# Altium project KIT_PIC16F877A.PrjPcb
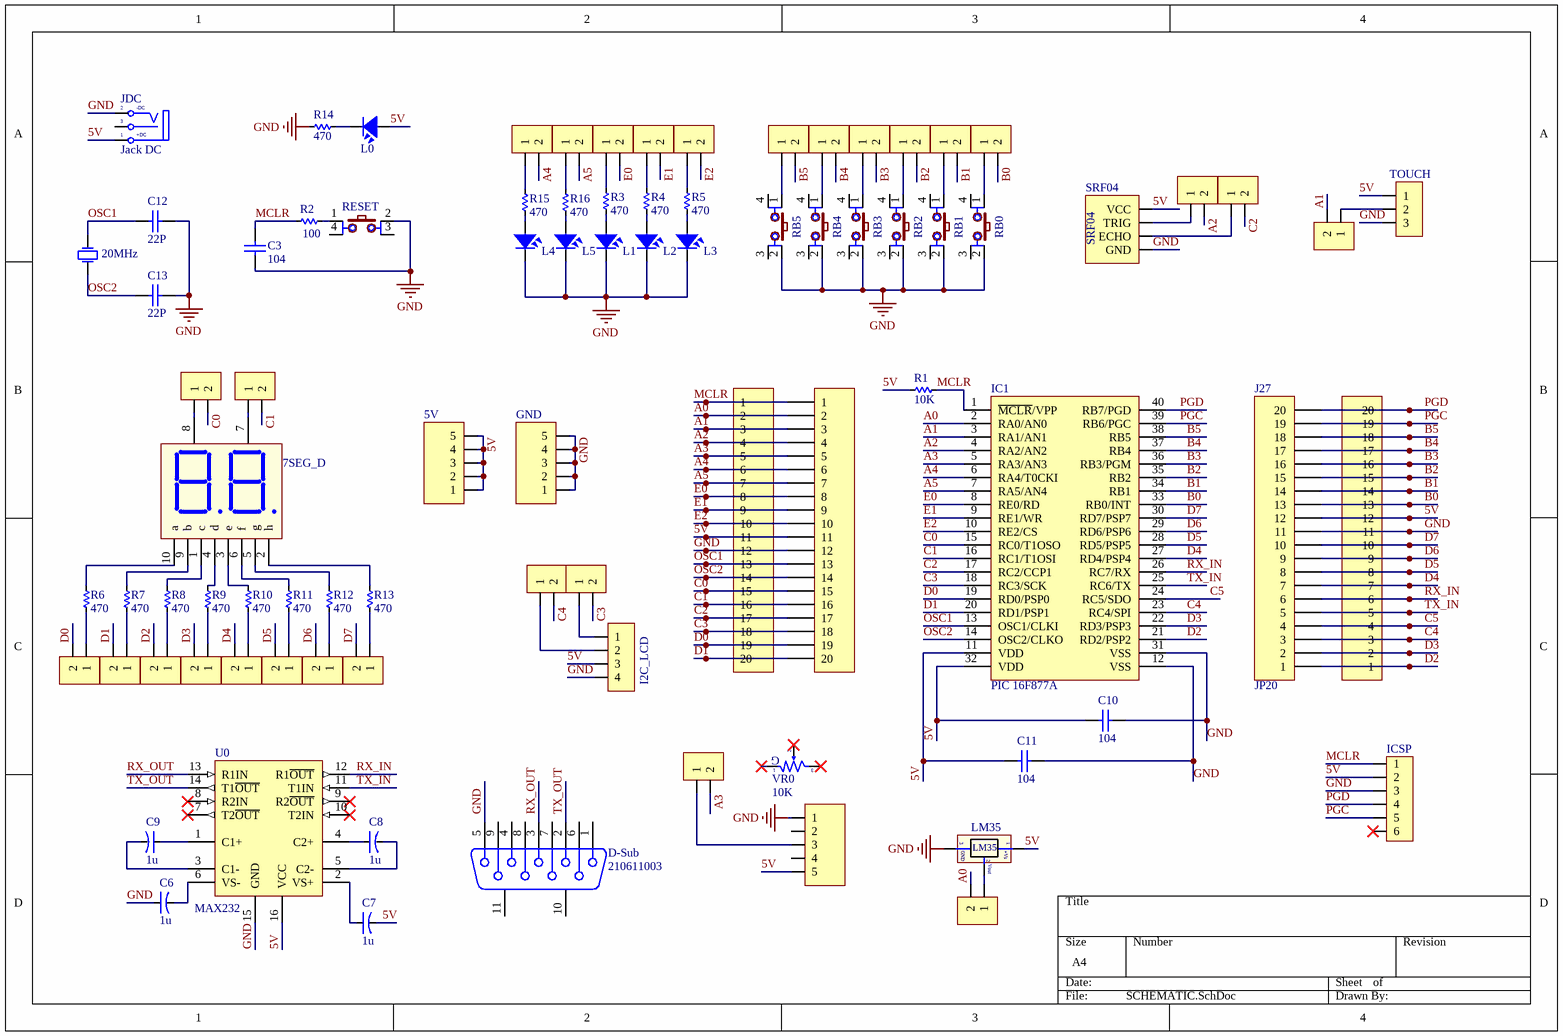
[diagram p0: SCHEMATIC.SchDoc]
1 sheet, 85 parts. Net scope: global (net labels, ports and power ports of the same name join across sheets).
Board file: PCB_KIT_PIC16F877A.PcbDoc

## Sheet SCHEMATIC.SchDoc
size A4; PageSetup: Record=PageOptions|CenterHorizontal=True|CenterVertical=True|PrintScale=0.94|XCorrection=0.00|YCorrection=0.00|PrintKind=0|BorderSize=5000000|LeftOffset=0|BottomOffset=0|Orientation=2|PaperLength=1000|PaperWidth=1000|Scale=100|PaperSource=7|PrintQuality=-3|MediaType=1|DitherType=10|PrintScaleMode=1|PaperKind=A4|PaperIndex=9

### Parts
5V  JP5  [JP5-C1T]  (value not drawn)
C3  value 104  [CN1.5]  (hidden comment: Cap Non-Pol)
C6  1u  [CA-ALU-2.54]
C7  1u  [CA-ALU-2.54]
C8  1u  [CA-ALU-2.54]
C9  1u  [CA-ALU-2.54]
C10  value 104  [CN1.5]  (hidden comment: Cap Non-Pol)
C11  value 104  [CN1.5]  (hidden comment: Cap Non-Pol)
C12  value 22P  [CN1.5]  (hidden comment: Cap Non-Pol)
C13  value 22P  [CN1.5]  (hidden comment: Cap Non-Pol)
D-Sub  210611003  [COM9B]
DS0  7SEG_D  [7SEG-D]
GND  JP5  [JP5-C1T]  (value not drawn)
I2C_LCD  JP4  [JP4-C1T]  (value not drawn)
IC1  PIC 16F877A  [DIP40_Socket]
ICSP  Header6  [Header6]  (value not drawn)
J0  JP20  [JP20-C1T]  (value not drawn)
J2  JP20  [JP20-D1T]  (value not drawn)
J26  JP20  [JP20-C1T]  (value not drawn)
J27  JP20  [JP20-D1T]
J28  JP5  [JP5-C1T]  (value not drawn)
J29  JP2  [JP2-D1T]  (value not drawn)
JDC  Jack DC  [DC0]
JP0  JP2  [JP2-D1T]  (value not drawn)
JP1  JP2  [JP2-D1T]  (value not drawn)
JP2  JP2  [JP2-D1T]  (value not drawn)
JP3  JP2  [JP2-D1T]  (value not drawn)
JP4  JP2  [JP2-D1T]  (value not drawn)
JP5  JP2  [JP2-D1T]  (value not drawn)
JP6  JP2  [JP2-D1T]  (value not drawn)
JP7  JP2  [JP2-D1T]  (value not drawn)
JP8  JP2  [JP2-D1T]  (value not drawn)
JP9  JP2  [JP2-D1T]  (value not drawn)
JP10  JP2  [JP2-D1T]  (value not drawn)
JP11  JP2  [JP2-D1T]  (value not drawn)
JP12  JP2  [JP2-D1T]  (value not drawn)
JP13  JP2  [JP2-D1T]  (value not drawn)
JP14  JP2  [JP2-D1T]  (value not drawn)
JP15  JP2  [JP2-D1T]  (value not drawn)
JP16  JP2  [JP2-D1T]  (value not drawn)
JP17  JP2  [JP2-D1T]  (value not drawn)
JP18  JP2  [JP2-D1T]  (value not drawn)
JP19  JP2  [JP2-D1T]  (value not drawn)
JP20  JP2  [JP2-D1T]  (value not drawn)
JP21  JP2  [JP2-D1T]  (value not drawn)
JP22  JP2  [JP2-D1T]  (value not drawn)
JP23  JP2  [JP2-D1T]  (value not drawn)
JP25  JP2  [JP2-D1T]  (value not drawn)
JP26  JP2  [JP2-D1T]  (value not drawn)
JP27  JP2  [JP2-D1T]  (value not drawn)
L0  LED  [LED-5-RED]  (value not drawn)
L1  LED  [LED-5-RED]  (value not drawn)
L2  LED  [LED-5-RED]  (value not drawn)
L3  LED  [LED-5-RED]  (value not drawn)
L4  LED  [LED-5-RED]  (value not drawn)
L5  LED  [LED-5-RED]  (value not drawn)
LM35  LM35  [TO92-123]  (value not drawn)
R1  10K  [RES-1/4W-SMALL]
R2  100  [RES-1/4W-SMALL]
R3  470  [RES-1/4W-SMALL]
R4  470  [RES-1/4W-SMALL]
R5  470  [RES-1/4W-SMALL]
R6  470  [RES-1/4W-SMALL]
R7  470  [RES-1/4W-SMALL]
R8  470  [RES-1/4W-SMALL]
R9  470  [RES-1/4W-SMALL]
R10  470  [RES-1/4W-SMALL]
R11  470  [RES-1/4W-SMALL]
R12  470  [RES-1/4W-SMALL]
R13  470  [RES-1/4W-SMALL]
R14  470  [RES-1/4W-SMALL]
R15  470  [RES-1/4W-SMALL]
R16  470  [RES-1/4W-SMALL]
RB0  (no value)  [SW2-DIP]
RB1  (no value)  [SW2-DIP]
RB2  (no value)  [SW2-DIP]
RB3  (no value)  [SW2-DIP]
RB4  (no value)  [SW2-DIP]
RB5  (no value)  [SW2-DIP]
RESET  (no value)  [SW2-DIP]
SRF04  SRF04  [SRF04]  (value not drawn)
TOUCH  JP3  [JP3-C1T]  (value not drawn)
U0  MAX232  [DIP16]
VR0  10K  [VR-S1]
Y1  20MHz  [xtal]

### Nets
GND: C3.2 C6.1 C10.2 C11.2 C12.2 C13.2 D-Sub.5 GND.1 GND.2 GND.3 GND.4 GND.5 I2C_LCD.4 IC1.12(VSS) IC1.31(VSS) ICSP.3 J0.11 J2.12 J26.12 J27.11 J28.1 JDC.2(TN) L1.2 L2.2 L3.2 L4.2 L5.2 LM35.3(-) R14.2 RB0.2 RB1.2 RB2.2 RB3.2 RB4.2 RB5.2 RESET.2 SRF04.1(GND) TOUCH.3 U0.15(GND)
5V: 5V.1 5V.2 5V.3 5V.4 5V.5 C7.2 C10.1 C11.1 I2C_LCD.3 IC1.11(VDD) IC1.32(VDD) ICSP.2 J0.12 J2.11 J26.11 J27.12 J28.5 JDC.1(T) L0.1 LM35.1(+Vs) R1.2 SRF04.4(VCC) TOUCH.1 U0.16(VCC)
A0: IC1.2(RA0/AN0) J2.2 J26.2 JP25.2
A1: IC1.3(RA1/AN1) J2.3 J26.3 JP11.2
A2: IC1.4(RA2/AN2) J2.4 J26.4 JP9.2
A3: IC1.5(RA3/AN3) J2.5 J26.5 J29.2
A4: IC1.6(RA4/T0CKI) J2.6 J26.6 JP26.2
A5: IC1.7(RA5/AN4) J2.7 J26.7 JP27.2
B0: IC1.33(RB0/INT) J0.13 J27.13 JP3.2
B1: IC1.34(RB1) J0.14 J27.14 JP4.2
B2: IC1.35(RB2) J0.15 J27.15 JP5.2
B3: IC1.36(RB3/PGM) J0.16 J27.16 JP6.2
B4: IC1.37(RB4) J0.17 J27.17 JP7.2
B5: IC1.38(RB5) J0.18 J27.18 JP8.2
C0: IC1.15(RC0/T1OSO) J2.15 J26.15 JP12.2
C1: IC1.16(RC1/T1OSI) J2.16 J26.16 JP13.2
C2: IC1.17(RC2/CCP1) J2.17 J26.17 JP10.2
C3: IC1.18(RC3/SCK) J2.18 J26.18 JP23.2
C4: IC1.23(RC4/SPI) J0.3 J27.3 JP22.2
C5: IC1.24(RC5/SDO) J0.4 J27.4
D0: IC1.19(RD0/PSP0) J2.19 J26.19 JP14.2
D1: IC1.20(RD1/PSP1) J2.20 J26.20 JP15.2
D2: IC1.21(RD2/PSP2) J0.1 J27.1 JP16.2
D3: IC1.22(RD3/PSP3) J0.2 J27.2 JP17.2
D4: IC1.27(RD4/PSP4) J0.7 J27.7 JP18.2
D5: IC1.28(RD5/PSP5) J0.8 J27.8 JP19.2
D6: IC1.29(RD6/PSP6) J0.9 J27.9 JP20.2
D7: IC1.30(RD7/PSP7) J0.10 J27.10 JP21.2
E0: IC1.8(RE0/RD) J2.8 J26.8 JP0.2
E1: IC1.9(RE1/WR) J2.9 J26.9 JP1.2
E2: IC1.10(RE2/CS) J2.10 J26.10 JP2.2
MCLR: C3.1 IC1.1(~{MCLR}/VPP) ICSP.1 J2.1 J26.1 R1.1 R2.2
OSC1: C12.1 IC1.13(OSC1/CLKI) J2.13 J26.13 Y1.2(OSC2)
OSC2: C13.1 IC1.14(OSC2/CLKO) J2.14 J26.14 Y1.1(OSC1)
PGC: IC1.39(RB6/PGC) ICSP.5 J0.19 J27.19
PGD: IC1.40(RB7/PGD) ICSP.4 J0.20 J27.20
RX_IN: IC1.26(RC7/RX) J0.6 J27.6 U0.12(R1~{OUT})
RX_OUT: D-Sub.3 U0.13(R1IN)
TX_IN: IC1.25(RC6/TX) J0.5 J27.5 U0.11(T1IN)
TX_OUT: D-Sub.2 U0.14(T1~{OUT})
NetC6_2: C6.2 U0.6(VS-)
NetC7_1: C7.1 U0.2(VS+)
NetC8_1: C8.1 U0.4(C2+)
NetC8_2: C8.2 U0.5(C2-)
NetC9_1: C9.1 U0.1(C1+)
NetC9_2: C9.2 U0.3(C1-)
NetDS0_1: DS0.1(c) R8.1
NetDS0_2: DS0.2(h) R13.1
NetDS0_3: DS0.3(e) R10.1
NetDS0_4: DS0.4(d) R9.1
NetDS0_5: DS0.5(g) R12.1
NetDS0_6: DS0.6(f) R11.1
NetDS0_7: DS0.7(L2) JP13.1
NetDS0_8: DS0.8(Vcc) JP12.1
NetDS0_9: DS0.9(b) R7.1
NetDS0_10: DS0.10(a) R6.1
NetI2C_LCD_1: I2C_LCD.1 JP23.1
NetI2C_LCD_2: I2C_LCD.2 JP22.1
NetJ28_3: J28.3 J29.1
NetJP0_1: JP0.1 R3.1
NetJP1_1: JP1.1 R4.1
NetJP2_1: JP2.1 R5.1
NetJP3_1: JP3.1 RB0.1
NetJP4_1: JP4.1 RB1.1
NetJP5_1: JP5.1 RB2.1
NetJP6_1: JP6.1 RB3.1
NetJP7_1: JP7.1 RB4.1
NetJP8_1: JP8.1 RB5.1
NetJP9_1: JP9.1 SRF04.3(TRIG)
NetJP10_1: JP10.1 SRF04.2(ECHO)
NetJP11_1: JP11.1 TOUCH.2
NetJP14_1: JP14.1 R6.2
NetJP15_1: JP15.1 R7.2
NetJP16_1: JP16.1 R8.2
NetJP17_1: JP17.1 R9.2
NetJP18_1: JP18.1 R10.2
NetJP19_1: JP19.1 R11.2
NetJP20_1: JP20.1 R12.2
NetJP21_1: JP21.1 R13.2
NetJP25_1: JP25.1 LM35.2(Vout)
NetJP26_1: JP26.1 R15.1
NetJP27_1: JP27.1 R16.1
NetL0_2: L0.2 R14.1
NetL1_1: L1.1 R3.2
NetL2_1: L2.1 R4.2
NetL3_1: L3.1 R5.2
NetL4_1: L4.1 R15.2
NetL5_1: L5.1 R16.2
NetR2_1: R2.1 RESET.1

Not connected (* = marked no-connect by the designer): D-Sub 1 4 6 7 8 9 10(MH1) 11(MH2); ICSP 6*; J28 2 4; JDC 3(S); RB0 3 4; RB1 3 4; RB2 3 4; RB3 3 4; RB4 3 4; RB5 3 4; RESET 3 4; U0 7(T2~{OUT})* 8(R2IN)* 9(R2~{OUT})* 10(T2IN)*; VR0 1* 2* 3*

### Notes on the sheet
- (in symbol DCIN) -DC; +DC
- (in symbol LM35) GND
- (in symbol VR-S) G

### Library data of the parts
5V GND J28 = JP5: WR-PHD 2.54 mm Angled Socket Header; Manufacturer: W¨¹rth Elektronik eiSos GmbH; partNo: 613005143121; ComponentLink1 Description: Manufacturer; ComponentLink2 Description: Datasheet; NoPins: 05; Created Date: 29 March 2013; ComponentLink1URL: http://www.we-online.com; ComponentLink2URL: http://katalog.we-online.de/em/datasheet/6130xx143121.pdf; Created by: Karrer Zheng
C3 C10-C13 = Cap Non-Pol: Capacitor
C6-C9 = CN-ALU-DIP: Capacitor (Semiconductor SIM Model); Value: 104; LatestRevisionDate: 17-Jul-2002; LatestRevisionNote: Re-released for DXP Platform.; PackageReference: C1206; Publisher: Altium Limited
D-Sub = CON 9BD: D-SUB-Filter Connectors WE-DS, Solder Pin Straight; Manufacturer: Würth Elektronik eiSos GmbH; partNo: 210611003; ComponentLink1Description: Manufacturer; ComponentLink1URL: http://www.we-online.de; Created by: Christin Zierenner; Created Date: May 2012; ComponentLink2Description: Datasheet; ComponentLink2URL: http://katalog.we-online.de/kataloge/eisos/index.php?language=en&pf=Filter_gerade
DS0 = LED7-D: Dual 7 Seg Dipslay; Value: LED 7S SEG
I2C_LCD = JP4: WR-PHD 2.54 mm Angled Socket Header; Manufacturer: W¨¹rth Elektronik eiSos GmbH; partNo: 613004143121; ComponentLink1 Description: Manufacturer; ComponentLink2 Description: Datasheet; NoPins: 04; Created Date: 29 March 2013; ComponentLink1URL: http://www.we-online.com; ComponentLink2URL: http://katalog.we-online.de/em/datasheet/6130xx143121.pdf; Created by: Karrer Zheng
IC1 = PIC16F877-PU: 8K FLASH, 368B RAM, 256B EFROM; Value: DIP 40; Value: PIC16F877A; Copyright by: VanDungEvn
ICSP = Header6: Header IDC, 6 x 1 Pin Vertical 2.54mm Pitch (Non-Boxed, Male); Manufacturer: W¨¹rth Elektronik eiSos GmbH; partNo: 613002143121; ComponentLink1 Description: Manufacturer; ComponentLink2 Description: Datasheet; NoPins: 02; Created Date: 29 March 2013; ComponentLink1URL: http://www.we-online.com; ComponentLink2URL: http://katalog.we-online.de/em/datasheet/6130xx143121.pdf; Created by: Karrer Zheng
J0 J2 J26 J27 = JP20: WR-PHD 2.54 mm Angled Socket Header; Manufacturer: W¨¹rth Elektronik eiSos GmbH; partNo: 613020143121; ComponentLink1 Description: Manufacturer; ComponentLink2 Description: Datasheet; NoPins: 20; Created Date: 29 March 2013; ComponentLink1URL: http://www.we-online.com; ComponentLink2URL: http://katalog.we-online.de/em/datasheet/6130xx143121.pdf; Created by: Karrer Zheng
J29 JP0-JP23 JP25-JP27 = JP2: WR-PHD 2.54 mm Angled Socket Header; Manufacturer: W¨¹rth Elektronik eiSos GmbH; partNo: 613002143121; ComponentLink1 Description: Manufacturer; ComponentLink2 Description: Datasheet; NoPins: 02; Created Date: 29 March 2013; ComponentLink1URL: http://www.we-online.com; ComponentLink2URL: http://katalog.we-online.de/em/datasheet/6130xx143121.pdf; Created by: Karrer Zheng
JDC = DCIN: Jac DC input; Value: Jac DC
L0-L5 = LED: LED Single colour Green and Red; Value: LED 3 ly Single Colour
LM35 = LM35: Teminal; Value: LM35
R1-R16 = Res: Manufacturer: Generic Components; Class: Passive; SubClass: R; Published: 08/06/2000; Publisher: Altium Hobart Technology Centre
RB0-RB5 RESET = SW4: Switch button 4 pin; Value: Button chip 4 pin
SRF04 = SRF04: Manufacturer: W¨¹rth Elektronik eiSos GmbH; partNo: 613004143121; ComponentLink1 Description: Manufacturer; ComponentLink2 Description: Datasheet; NoPins: 04; Created Date: 29 March 2013; ComponentLink1URL: http://www.we-online.com; ComponentLink2URL: http://katalog.we-online.de/em/datasheet/6130xx143121.pdf; Created by: Karrer Zheng
TOUCH = JP3: WR-PHD 2.54 mm Angled Socket Header; Manufacturer: W¨¹rth Elektronik eiSos GmbH; partNo: 613003143121; ComponentLink1 Description: Manufacturer; ComponentLink2 Description: Datasheet; NoPins: 03; Created Date: 29 March 2013; ComponentLink1URL: http://www.we-online.com; ComponentLink2URL: http://katalog.we-online.de/em/datasheet/6130xx143121.pdf; Created by: Karrer Zheng
U0 = MAX232: RS232 LEVEL SHIFTER; Manufacturer Part Number: MAX232DR; Manufacturer: Texas Instruments; Number of Drivers/Receivers: 2/2; Voltage - Supply: 4.5 V ~ 5.5 V; Supplier 1: Digi-Key; Supplier Part Number 1: 296-14619-1-ND; RoHS: RoHS Compliant; Packaging: Cut Tape (CT); Protocol: RS232; Type: Transceiver; Supplier Part Number: 296-14619-1-ND; Supplier: Digi-Key; Category: Integrated Circuits (ICs); Package / Case: 16-SOIC (3.9mm Width)
VR0 = VR-S: Var Resistor; Value: Volume 50k
Y1 = Crystal: Crystal Oscillator; Published: 8-Jun-2000; LatestRevisionDate: 17-Jul-2002; LatestRevisionNote: Re-released for DXP Platform.; PackageReference: R38; Publisher: Altium Limited